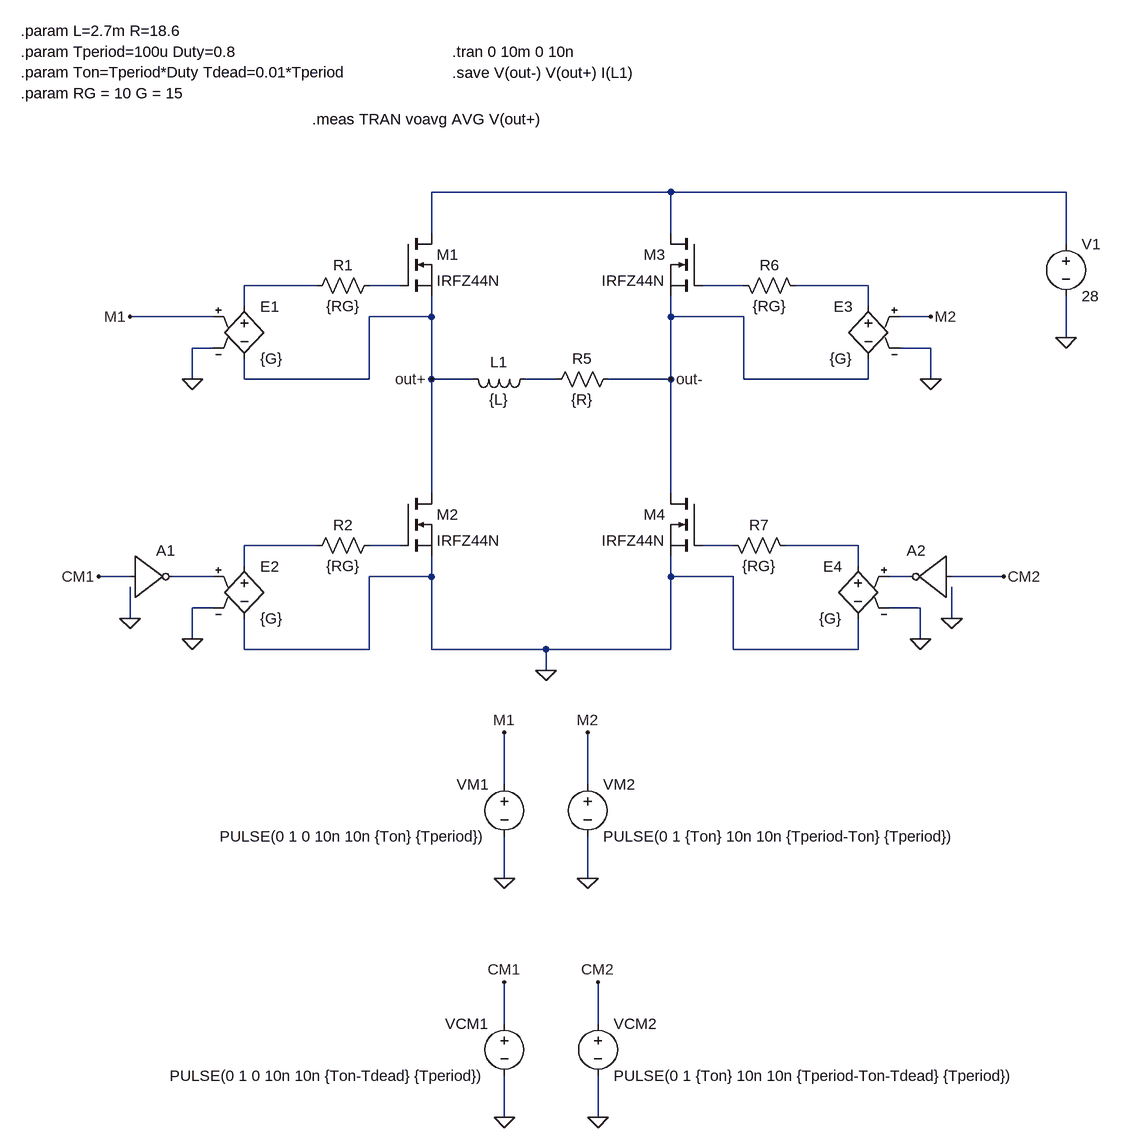
[diagram p0: schematic bridge.asc]
bridge.asc, the LTspice schematic file:
Version 4
SHEET 1 2924 1444
WIRE 816 -64 448 -64
WIRE 1424 -64 816 -64
WIRE 448 0 448 -64
WIRE 816 0 816 -64
WIRE 1424 16 1424 -64
WIRE 272 80 160 80
WIRE 400 80 352 80
WIRE 928 80 864 80
WIRE 1120 80 1008 80
WIRE 160 112 160 80
WIRE 1120 112 1120 80
WIRE 112 128 -16 128
WIRE 448 128 448 96
WIRE 448 128 352 128
WIRE 816 128 816 96
WIRE 928 128 816 128
WIRE 1216 128 1168 128
WIRE 1424 160 1424 96
WIRE 112 176 80 176
WIRE 1216 176 1168 176
WIRE 80 224 80 176
WIRE 160 224 160 192
WIRE 352 224 352 128
WIRE 352 224 160 224
WIRE 448 224 448 128
WIRE 512 224 448 224
WIRE 640 224 592 224
WIRE 816 224 816 128
WIRE 816 224 720 224
WIRE 928 224 928 128
WIRE 1120 224 1120 192
WIRE 1120 224 928 224
WIRE 1216 224 1216 176
WIRE 448 400 448 224
WIRE 816 400 816 224
WIRE 272 480 160 480
WIRE 400 480 352 480
WIRE 912 480 864 480
WIRE 1104 480 992 480
WIRE 160 512 160 480
WIRE 1104 512 1104 480
WIRE -16 528 -64 528
WIRE 112 528 48 528
WIRE 448 528 448 496
WIRE 448 528 352 528
WIRE 816 528 816 496
WIRE 912 528 816 528
WIRE 1184 528 1152 528
WIRE 1328 528 1248 528
WIRE 112 576 80 576
WIRE 1200 576 1152 576
WIRE -16 592 -16 544
WIRE 1248 592 1248 544
WIRE 80 624 80 576
WIRE 1200 624 1200 576
WIRE 160 640 160 592
WIRE 352 640 352 528
WIRE 352 640 160 640
WIRE 448 640 448 528
WIRE 624 640 448 640
WIRE 816 640 816 528
WIRE 816 640 624 640
WIRE 912 640 912 528
WIRE 1104 640 1104 592
WIRE 1104 640 912 640
WIRE 624 672 624 640
WIRE 560 848 560 768
WIRE 688 848 688 768
WIRE 560 992 560 928
WIRE 688 992 688 928
WIRE 560 1216 560 1152
WIRE 704 1216 704 1152
WIRE 560 1360 560 1296
WIRE 704 1360 704 1296
FLAG 1424 160 0
FLAG 624 672 0
FLAG 80 224 0
FLAG 80 624 0
FLAG 1216 224 0
FLAG 1200 624 0
FLAG -16 592 0
FLAG -64 528 CM1
FLAG -16 128 M1
FLAG 1216 128 M2
FLAG 1248 592 0
FLAG 1328 528 CM2
FLAG 560 992 0
FLAG 688 992 0
FLAG 560 768 M1
FLAG 688 768 M2
FLAG 816 224 out-
FLAG 448 224 out+
FLAG 560 1360 0
FLAG 560 1152 CM1
FLAG 704 1152 CM2
FLAG 704 1360 0
SYMBOL voltage 1424 0 R0
WINDOW 123 0 0 Left 0
WINDOW 39 0 0 Left 0
SYMATTR InstName V1
SYMATTR Value 28
SYMBOL nmos 400 0 R0
SYMATTR InstName M1
SYMATTR Value IRFZ44N
SYMBOL nmos 400 400 R0
SYMATTR InstName M2
SYMATTR Value IRFZ44N
SYMBOL nmos 864 0 M0
SYMATTR InstName M3
SYMATTR Value IRFZ44N
SYMBOL nmos 864 400 M0
SYMATTR InstName M4
SYMATTR Value IRFZ44N
SYMBOL res 368 64 R90
WINDOW 0 0 56 VBottom 2
WINDOW 3 32 56 VTop 2
SYMATTR InstName R1
SYMATTR Value {RG}
SYMBOL res 368 464 R90
WINDOW 0 0 56 VBottom 2
WINDOW 3 32 56 VTop 2
SYMATTR InstName R2
SYMATTR Value {RG}
SYMBOL ind 608 208 R90
WINDOW 0 5 56 VBottom 2
WINDOW 3 32 56 VTop 2
SYMATTR InstName L1
SYMATTR Value {L}
SYMBOL res 736 208 R90
WINDOW 0 0 56 VBottom 2
WINDOW 3 32 56 VTop 2
SYMATTR InstName R5
SYMATTR Value {R}
SYMBOL e 160 96 R0
SYMATTR InstName E1
SYMATTR Value {G}
SYMBOL e 160 496 R0
SYMATTR InstName E2
SYMATTR Value {G}
SYMBOL res 912 64 M90
WINDOW 0 0 56 VBottom 2
WINDOW 3 32 56 VTop 2
SYMATTR InstName R6
SYMATTR Value {RG}
SYMBOL e 1120 96 M0
SYMATTR InstName E3
SYMATTR Value {G}
SYMBOL res 896 464 M90
WINDOW 0 0 56 VBottom 2
WINDOW 3 32 56 VTop 2
SYMATTR InstName R7
SYMATTR Value {RG}
SYMBOL e 1104 496 M0
SYMATTR InstName E4
SYMATTR Value {G}
SYMBOL Digital\\inv -16 464 R0
SYMATTR InstName A1
SYMBOL Digital\\inv 1248 464 M0
SYMATTR InstName A2
SYMBOL voltage 560 832 M0
WINDOW 123 0 0 Left 0
WINDOW 39 0 0 Left 0
SYMATTR InstName VM1
SYMATTR Value PULSE(0 1 0 10n 10n {Ton} {Tperiod})
SYMBOL voltage 688 832 R0
WINDOW 123 0 0 Left 0
WINDOW 39 0 0 Left 0
SYMATTR InstName VM2
SYMATTR Value PULSE(0 1 {Ton} 10n 10n {Tperiod-Ton} {Tperiod})
SYMBOL voltage 560 1200 M0
WINDOW 123 0 0 Left 0
WINDOW 39 0 0 Left 0
SYMATTR InstName VCM1
SYMATTR Value PULSE(0 1 0 10n 10n {Ton-Tdead} {Tperiod})
SYMBOL voltage 704 1200 R0
WINDOW 123 0 0 Left 0
WINDOW 39 0 0 Left 0
SYMATTR InstName VCM2
SYMATTR Value PULSE(0 1 {Ton} 10n 10n {Tperiod-Ton-Tdead} {Tperiod})
TEXT 480 -280 Left 2 !.tran 0 10m 0 10n
TEXT -184 -280 Left 2 !.param Tperiod=100u Duty=0.8 \n.param Ton=Tperiod*Duty Tdead=0.01*Tperiod
TEXT 480 -248 Left 2 !.save V(out-) V(out+) I(L1)
TEXT -184 -312 Left 2 !.param L=2.7m R=18.6
TEXT -184 -216 Left 2 !.param RG = 10 G = 15
TEXT 264 -176 Left 2 !.meas TRAN voavg AVG V(out+)

The netlist it stands for:
* bridge.asc
V1 N001 0 28
M1 N001 N003 out+ out+ IRFZ44N
M2 out+ N008 0 0 IRFZ44N
M3 N001 N004 out- out- IRFZ44N
M4 out- N009 0 0 IRFZ44N
R1 N003 N002 {RG}
R2 N008 N007 {RG}
L1 N006 out+ {L}
R5 out- N006 {R}
E1 N002 out+ M1 0 {G}
E2 N007 0 N011 0 {G}
R6 N004 N005 {RG}
E3 N005 out- M2 0 {G}
R7 N009 N010 {RG}
E4 N010 0 N012 0 {G}
A1 CM1 0 0 0 0 N011 0 0 BUF
A2 CM2 0 0 0 0 N012 0 0 BUF
VM1 M1 0 PULSE(0 1 0 10n 10n {Ton} {Tperiod})
VM2 M2 0 PULSE(0 1 {Ton} 10n 10n {Tperiod-Ton} {Tperiod})
VCM1 CM1 0 PULSE(0 1 0 10n 10n {Ton-Tdead} {Tperiod})
VCM2 CM2 0 PULSE(0 1 {Ton} 10n 10n {Tperiod-Ton-Tdead} {Tperiod})
.model NMOS NMOS
.model PMOS PMOS
.lib standard.mos
.tran 0 10m 0 10n
.param Tperiod=100u Duty=0.8
.param Ton=Tperiod*Duty Tdead=0.01*Tperiod
.save V(out-) V(out+) I(L1)
.param L=2.7m R=18.6
.param RG = 10 G = 15
.meas TRAN voavg AVG V(out+)
.backanno
.end